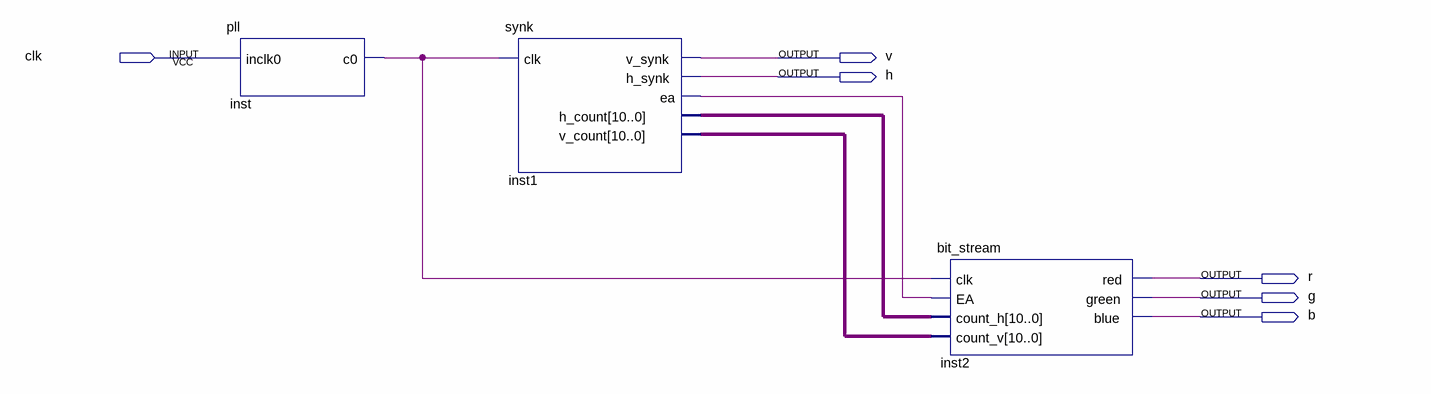
[diagram p0: schematic sheet]
// Quartus schematic vga.bdf as structural Verilog: 3 symbols, 6 pins
module vga (
  input  clk,
  output v,
  output h,
  output r,
  output g,
  output b
);

  wire inst1_ea, inst_c0;
  wire [10:0] inst1_h_count, inst1_v_count;

  pll inst (.inclk0(clk), .c0(inst_c0));
  synk inst1 (.clk(inst_c0), .v_synk(v), .h_synk(h), .ea(inst1_ea), .h_count(inst1_h_count), .v_count(inst1_v_count));
  bit_stream inst2 (
    .clk(inst_c0), .EA(inst1_ea), .count_h(inst1_h_count), .count_v(inst1_v_count), .red(r), .green(g),
    .blue(b));
endmodule
